# EAGLE design M_D_ext_power (EAGLE 9.6.2)
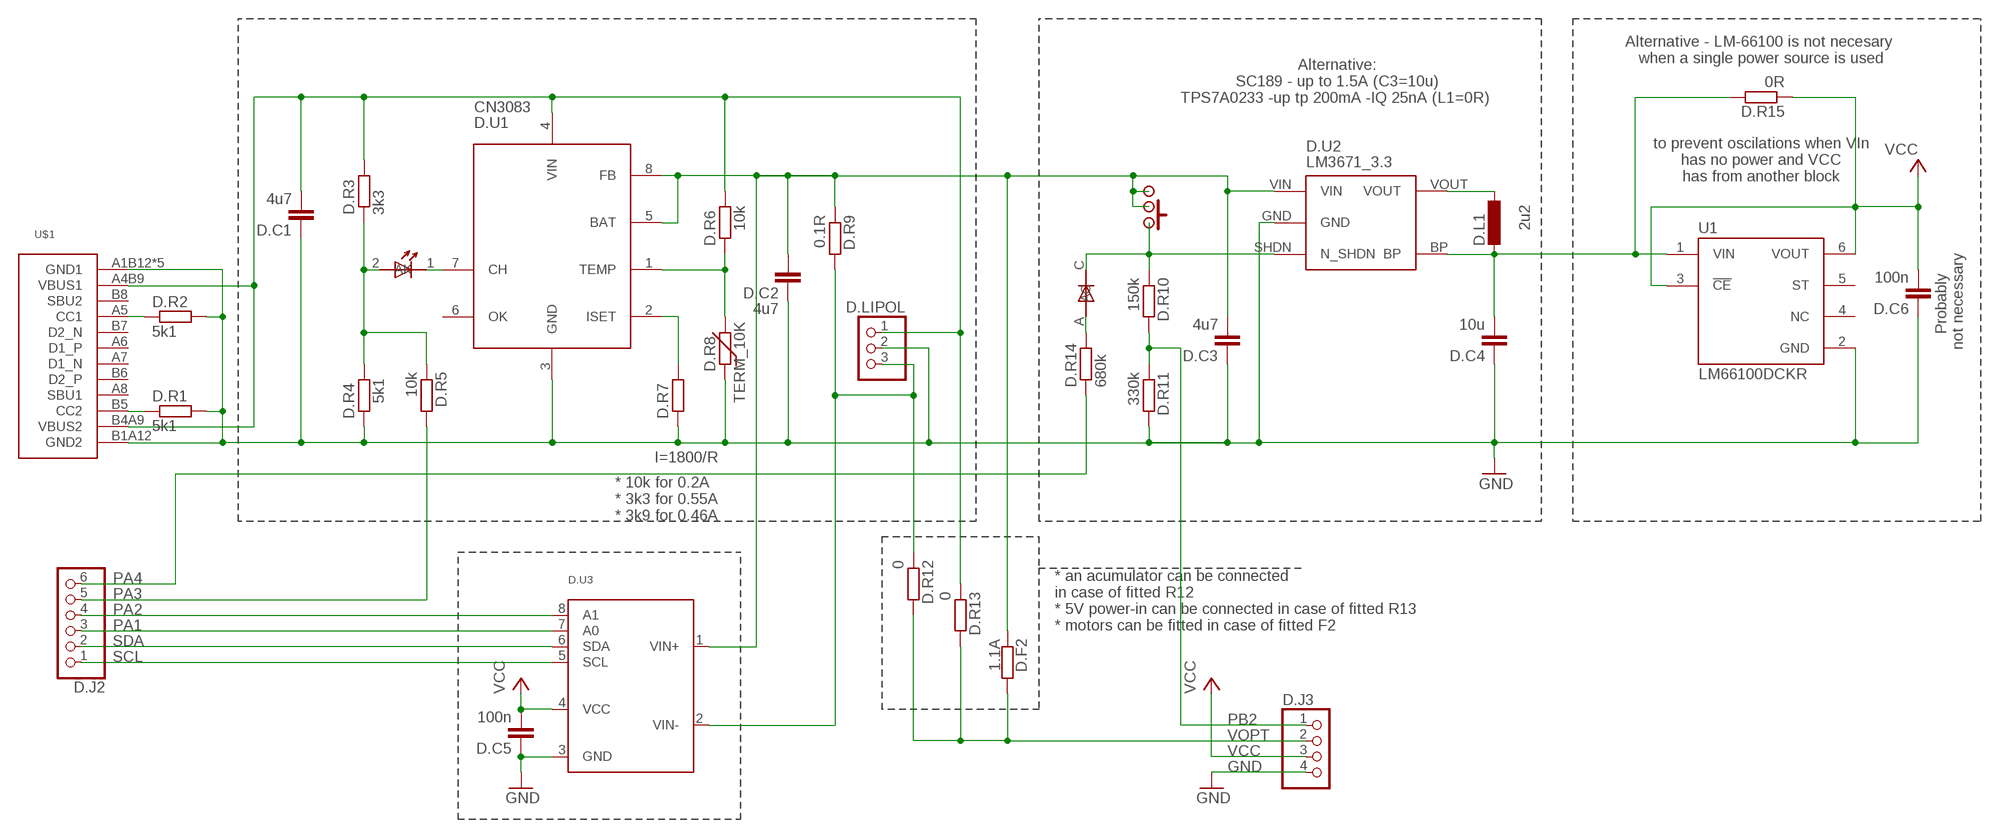
[diagram p0: schematic, sheet 1]

## Parts
D.C1  4u7  C-EUC0603  [C0603]
D.C2  4u7  C-EUC0603  [C0603]
D.C3  4u7  C-EUC0603  [C0603]
D.C4  10u  C-EUC0603  [C0603]
D.C5  100n  C-EUC0603  [C0603]
D.C6  100n  C-EUC0603  [C0603]
D.D1  LED_1.8  [LED_1.8]
D.D2  DIODE  [DIODE]
D.F2  1.1A  R-EU_R0805  [R0805]
D.J2  PINHD-1X6  [1X06]
D.J3  PINHD-1X4  [1X04]
D.L1  2u2  L-EUL3230M  [L3230M]
D.LIPOL  PINHEAD-1X3-2  [1X-03-2]
D.ON/OFF/RESET  SWITCH  [SWITCH]
D.R1  5k1  R-EU_R0603  [R0603]
D.R2  5k1  R-EU_R0603  [R0603]
D.R3  3k3  R-EU_R0603  [R0603]
D.R4  5k1  R-EU_R0603  [R0603]
D.R5  10k  R-EU_R0603  [R0603]
D.R6  10k  R-EU_R0603  [R0603]
D.R7  I=1800/R  R-EU_R0603  [R0603]
D.R8  TERM_10K  THERM  [THERM]
D.R9  0.1R  R-EU_R0805  [R0805]
D.R10  150k  R-EU_R0603  [R0603]
D.R11  330k  R-EU_R0603  [R0603]
D.R12  0  R-EU_R0603  [R0603]
D.R13  0  R-EU_R0603  [R0603]
D.R14  680k  R-EU_R0603  [R0603]
D.R15  0R  R-EU_R0603  [R0603]
D.U1  CN3083  [SOP8]
D.U2  LM3671_3.3  STABILISER_APE8865  [SOT32-5]
D.U3  INA219  [SOT23-8]
U1  LM66100DCKR  [SOT65P210X110-6N]
U$1  USB-C  [USB-C]

## Nets
5V: D.C1.2 D.LIPOL.1 D.R3.2 D.R6.2 D.R13.1 D.U1.4(VIN) U$1.A4B9(VBUS1) U$1.B4A9(VBUS2)
CHRG: D.D1.2(A) D.R3.1 D.R4.2 D.R5.1
GND: D.C1.1 D.C2.1 D.C3.1 D.C4.1 D.C5.1 D.C6.1 D.J3.4 D.LIPOL.2 D.R1.2 D.R2.2 D.R4.1 D.R7.1 D.R8.1 D.R11.2 D.U1.3(GND) D.U2.GND D.U3.3(GND) U1.2(GND) U$1.A1B12(GND1) U$1.B1A12(GND2) U$1.SH1(GND1) U$1.SH2(GND1) U$1.SH3(GND1) U$1.SH4(GND1)
IN+: D.C2.2 D.C3.2 D.F2.1 D.ON/OFF/RESET.P$2 D.ON/OFF/RESET.P$3 D.ON/OFF/RESET.P$4 D.ON/OFF/RESET.P$6 D.R9.1 D.U1.5(BAT) D.U1.8(FB) D.U2.VIN D.U3.1(VIN+)
IN-: D.LIPOL.3 D.R9.2 D.R12.1 D.U3.2(VIN-)
N$2: D.L1.1 D.U2.VOUT
N$3: D.D1.1(K) D.U1.7(CH)
N$4: D.R1.1 U$1.B5(CC2)
N$5: D.D2.A D.R14.2
N$6: D.R2.1 U$1.A5(CC1)
N$7: D.R7.2 D.U1.2(ISET)
N$8: D.R6.1 D.R8.2 D.U1.1(TEMP)
N$10: D.D2.C D.ON/OFF/RESET.P$1 D.ON/OFF/RESET.P$5 D.ON/OFF/RESET.P$7 D.R10.1 D.U2.SHDN(N_SHDN)
PA1: D.J2.3 D.U3.7(A0)
PA2: D.J2.4 D.U3.8(A1)
PA3: D.J2.5 D.R5.2
PA4: D.J2.6 D.R14.1
PB2: D.J3.1 D.R10.2 D.R11.1
SCL: D.J2.1 D.U3.5(SCL)
SDA: D.J2.2 D.U3.6(SDA)
VCC: D.C5.2 D.C6.2 D.J3.3 D.R15.1 D.U3.4(VCC) U1.3(!CE) U1.6(VOUT)
VCC1: D.C4.2 D.L1.2 D.R15.2 D.U2.BP U1.1(VIN)
VOPT: D.F2.2 D.J3.2 D.R12.2 D.R13.2
Unconnected: D.U1.6(OK) U1.4(NC) U1.5(ST) U$1.A6(D1_P) U$1.A7(D1_N) U$1.A8(SBU1) U$1.B6(D2_P) U$1.B7(D2_N) U$1.B8(SBU2)

## Notes on the sheet
- Alternative - LM-66100 is not necesary 
  when a single power source is used
- Alternative:
  SC189 - up to 1.5A (C3=10u)
  TPS7A0233 -up tp 200mA -IQ 25nA (L1=0R)
- to prevent oscilations when VIn
  has no power and VCC
  has from another block
- Probably 
  not necessary
- * 10k for 0.2A
  * 3k3 for 0.55A
  * 3k9 for 0.46A
- * an acumulator can be connected 
  in case of fitted R12  
  * 5V power-in can be connected in case of fitted R13 
  * motors can be fitted in case of fitted F2

## Library data of the parts
D.C1-D.C6 = rcl:C-EU: CAPACITOR, European symbol; SPICEPREFIX: C
D.D1 = hugo:LED_1.8
D.D2 = hugo:DIODE
D.F2 D.R1-D.R7 D.R9-D.R15 = rcl:R-EU_: RESISTOR, European symbol; SPICEPREFIX: R
D.J2 = pinhead2:PINHD-1X6: PIN HEADER
D.J3 = pinhead2:PINHD-1X4: PIN HEADER
D.L1 = rcl:L-EU: INDUCTOR, European symbol; SPICEPREFIX: L
D.LIPOL = pinhead2:PINHEAD-1X3-2
D.ON/OFF/RESET = hugo:SWITCH
D.R8 = hugo:THERM
D.U1 = hugo:CN3083
D.U2 = !stavebnice03:STABILISER_APE8865
D.U3 = hugo:INA219: INA219 - I2C Current/Power Monitor Voltage Range: 0-26V Accuracy: 0.5% Temperature: -40°C - 125°C
U1 = LM66100DCKR:LM66100DCKR: Check availability <https://pricing.snapeda.com/parts/LM66100DCKR/Texas%20Instruments/view-part?ref=eda>; AVAILABILITY: In Stock; CHECK_PRICES: https://www.snapeda.com/parts/LM66100DCKR/Texas+Instruments/view-part/?ref=eda; DESCRIPTION: 1.5-V to 5.5-V, 1.5-A, 0.5-µA IQ ideal diode with integrated FET; MF: Texas Instruments; MP: LM66100DCKR; PACKAGE: SOT-SC70-6 Texas Instruments; PRICE: None; SNAPEDA_LINK: https://www.snapeda.com/parts/LM66100DCKR/Texas+Instruments/view-part/?ref=snap
U$1 = hugo:USB-C

## Board
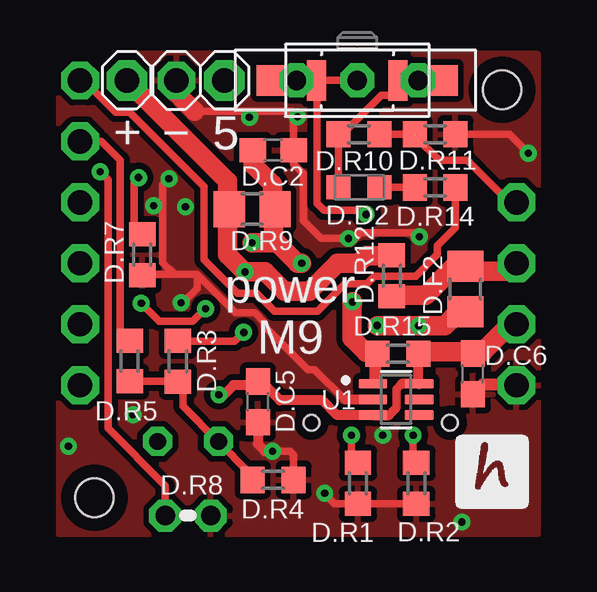
[diagram p1: board, top side]
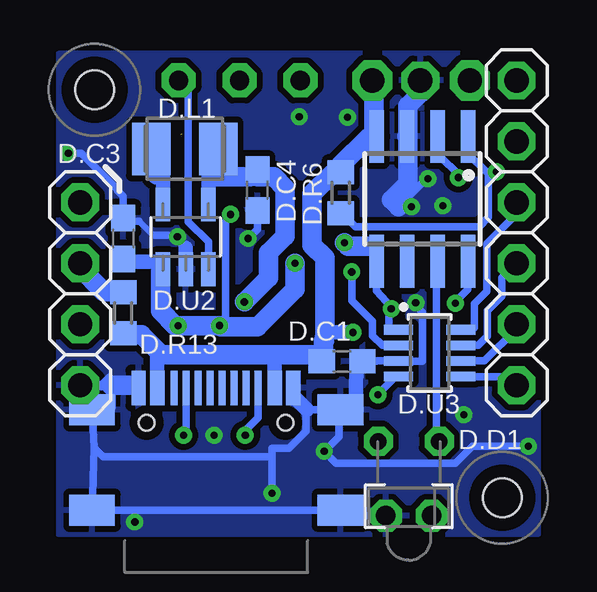
[diagram p2: board, bottom side, seen from below]

No outline drawn. Coordinates in mm, seen from the top.
Copper layers (1*16): Top 0.035mm / dielectric 1.5mm / Bottom 0.035mm
Design rules "default *": minimum track width 10mil, minimum drill 0.3mm, track to track 6mil, track to pad 6mil, pad to pad 6mil, via to via 10mil, smd to smd 10mil, copper to edge 15mil, drill to drill 15mil, minimum pad ring 10mil, minimum via ring 8mil, stop-mask expansion 4mil, vias tented up to drill 14mil, thermal gap 10mil
Holes 1.6 mm at 2,2 19,19
tRestrict: area 18,18 to 20,20; area 1,1 to 3,3
bRestrict: area 1,1 to 3,3; area 18,18 to 20,20

### Footprints (pad centres in the part's own frame; a part is rotated, then mirrored left to right if it is on the bottom)
C0603 = smd 1.1 x 1: 1 -0.85,0; 2 0.85,0
LED_1.8 = drill 0.7 octagon: 1 -1.27,-0.4; 2 1.27,-0.4
DIODE = smd 1 x 1: A 0.85,0; C -0.85,0
R0805 = smd 1.3 x 1.5: 1 -0.95,0; 2 0.95,0
1X06 = drill 1.016 pad 1.575 octagon: 1 -6.35,0; 2 -3.81,0; 3 -1.27,0; 4 1.27,0; 5 3.81,0; 6 6.35,0
1X04 = drill 1.016 pad 1.575 octagon: 1 -3.81,0; 2 -1.27,0; 3 1.27,0; 4 3.81,0
L3230M = smd 1.6 x 2.2: 1 -1.4,0; 2 1.4,0
1X-03-2 = drill 1.016 pad 1.676 octagon: 1 -2.016,0; 3 2.048,0 | drill 1.016 pad 1.575 octagon: 2 -0.016,0
SWITCH = drill 0.8 pad 1.422 octagon: P$1 2.54,0; P$2 0,0; P$3 -2.54,0 | smd 0.8 x 1.7: P$4 -1.7,0; P$5 1.7,0 | smd 1.27 x 1.27: P$6 -3.556,0; P$7 3.556,0
R0603 = smd 1 x 1.1: 1 -0.85,0; 2 0.85,0
THERM = drill 0.813 octagon: 1 -0.953,0; 2 0.953,0
SOP8 = smd 0.6 x 2.2: 1 -1.905,-2.6; 2 -0.635,-2.6; 3 0.635,-2.6; 4 1.905,-2.6; 5 1.905,2.6; 6 0.635,2.6; 7 -0.635,2.6; 8 -1.905,2.6
SOT32-5 = smd 0.6 x 1.4: BP 0.95,1.35; GND 0,-1.35; SHDN 0.95,-1.35; VIN -0.95,-1.35; VOUT -0.95,1.35
SOT23-8 = smd 0.4 x 1.2: 1 -0.975,-1.3; 2 -0.325,-1.3; 3 0.325,-1.3; 4 0.975,-1.3; 5 0.975,1.3; 6 0.325,1.3; 7 -0.325,1.3; 8 -0.975,1.3
SOT65P210X110-6N = smd 1.19 x 0.4: 1 -0.96,0.65; 2 -0.96,0; 3 -0.96,-0.65; 4 0.96,-0.65; 5 0.96,0; 6 0.96,0.65
USB-C = smd 0.6 x 1.45: A1B12 -3.235,3.825; A4B9 -2.46,3.825; B1A12 3.215,3.825; B4A9 2.44,3.825 | smd 0.3 x 1.45: A5 -1.26,3.825; A6 -0.26,3.825; A7 0.24,3.825; A8 1.24,3.825; B5 1.74,3.825; B6 0.74,3.825; B7 -0.76,3.825; B8 -1.76,3.825 | smd 1.9 x 1.3: SH1 -5.18,2.91; SH2 -5.18,-1.27; SH3 5.18,-1.27; SH4 5.18,2.91 | hole 0.65: 2.88,2.38; -2.9,2.38

### Placement (x,y rotation side)
D.C1  8.68,7.68 180 bottom
D.C2  9.45,16.49 180 top
D.C3  17.81,12.8 270 bottom
D.C4  12.21,14.82 90 bottom
D.C5  8.81,5.99 90 top
D.C6  17.78,7.16 90 top
D.D1  5.9,3.95 180 bottom
D.D2  13.03,14.94 0 top
D.F2  17.47,10.7 90 top
D.J2  1.4,13.04 90 bottom
D.J3  19.6,10.5 270 bottom
D.L1  15.24,16.54 0 bottom
D.LIPOL  5.4,19.39 180 top
D.ON/OFF/RESET  12.96,19.39 0 top
D.R1  12.99,2.6 270 top
D.R2  15.42,2.6 270 top
D.R3  5.48,7.69 90 top
D.R4  9.45,2.74 180 top
D.R5  3.47,7.7 90 top
D.R6  8.74,14.71 90 bottom
D.R7  4,12.12 90 top
D.R8  5.9,1.25 180 top
D.R9  8.58,14.03 180 top
D.R10  13.03,17.14 0 top
D.R11  16.21,17.14 0 top
D.R12  14.4,11.25 270 top
D.R13  17.81,9.7 90 bottom
D.R14  16.21,14.94 180 top
D.R15  14.66,8 180 top
D.U1  5.33,14.45 180 bottom
D.U2  15.2,12.87 0 bottom
D.U3  5.03,8.03 270 bottom
U1  14.58,6.1 0 top
U$1  13.93,2.75 0 bottom

### Tracks (layer width: path | path; a pad name or v marks a point on that pad's centre or on a via)
5V  (via drill 0.3)
  Top 0.305: D.R3.2 5.5,8.51 7.85,8.51 v8.22,8.89
  Bottom 0.254: 16.28,7.96 16.2,7.96
  Bottom 0.61: 11.49,7.02 U$1.B4A9 11.49,7.87 11.4,7.96 | D.R6.2 8.79,15.51 9.08,15.51 | U$1.A4B9 16.39,7.84 16.28,7.96 | 7.34,17.15 D.U1.4 7.26,17.03 7.57,17.03 | v8.22,8.89 9.4,8.89 | 9.4,8.69 9.42,8.69 | 9.42,8.53 9.45,8.53
  Bottom 0.813: D.R6.2 8.74,15.86 7.57,17.03 | 9.08,15.51 9.93,14.66 9.93,12.53 9.4,12 9.4,8.89 9.4,8.69 | D.C1.2 9.65,7.8 9.65,7.96 | 9.65,7.96 9.46,7.96 9.45,7.97 9.45,8.53 | 9.65,7.96 11.4,7.96 16.2,7.96 17.04,8.8 17.75,8.8 D.R13.1 | 7.34,17.15 7.34,18.88 7.67,19.21 D.LIPOL.1 | 9.42,8.69 9.42,8.53
CHRG
  Top 0.305: D.R4.2 8.6,2.9 7.05,4.45 7.05,4.35 D.D1.2 5.69,5.81 5.69,6.63 D.R3.1 D.R5.1
  Bottom 0.305: D.D1.2
GND  (via drill 0.3)
  Top 0.305: v11.6,2.18 11.6,2.16 12.01,1.75 12.9,1.75 12.88,1.77 D.R1.2 | 20.04,16.41 v20.09,16.36 19.3,17.14 D.R11.2 | D.R1.2 12.98,1.75 | D.R2.2 D.R1.2 | 8.59,18.11 10.26,18.11 10.3,18.07 D.C2.1 10.3,15.91 10.72,15.5 10.72,13.54 11.44,12.82 12.58,12.82 v12.6,12.8 12.46,12.66 12.73,12.66 13.11,13.04 15.38,13.04 v15.54,12.88 | 8.59,18.11 6.17,18.11 | v9.42,3.94 10.15,3.94 10.3,3.79 D.R4.1 | v5.61,10.12 5.7,10.12 6.29,10.71 6.29,11.3 6.28,11.3 | D.R7.1 4.03,11.3 5.33,11.3 | 6.28,11.3 5.33,11.3 | 6.28,11.3 7.88,9.7 8.69,9.7 9.07,9.32 9.07,9.17 10.9,7.34 11.18,7.34 12.42,6.1 12.45,6.1 | D.C6.1 18.18,6.71 | 5.33,11.3 4.85,11.79 4.85,15.04 v5.11,15.29 | v8.46,17.86 8.59,17.98 8.59,18.11
  Top 0.406: D.C5.1 8.81,4.23 9.11,3.94 v9.42,3.94 | 12.45,6.1 U1.2 | 19.57,6.71 D.J3.4
  Top 0.508: 19.57,6.71 18.18,6.71
  Top 0.61: 5.44,18.84 5.42,18.89 D.LIPOL.2
  Top 0.813: 6.17,18.11 5.44,18.84
  Bottom 0.254: 17.14,13.53 16.55,12.93
  Bottom 0.305: 11.6,3.72 18.64,3.72 19.01,4.09 | U$1.SH4 8.92,5.71 9.45,5.71 9.33,5.59 8.81,5.59 | U$1.SH1 19.01,4.09 | 19.01,4.09 U$1.SH2 U$1.SH3 8.64,1.25 D.R8.1 | 11.6,2.32 v11.6,2.18 | v11.6,2.18 11.58,2.16 | v11.6,2.18 11.6,3.72 | 11.6,3.72 11.6,4.07 10.89,4.07 10.19,4.78 10.19,5.49 10.02,5.66 U$1.SH4 | 8.11,5.6 8.13,5.59 8.81,5.59 | 8.08,7.43 D.C1.1 7.24,7.68 7.23,7.7 D.U3.3 5.32,7.69 5.32,7.7 5.32,9.73 5.65,10.06 v5.62,10.12 v5.61,10.12 | 10.71,6.24 U$1.B1A12 | U$1.SH4 10.14,5.66 | v20.09,16.36 19.56,16.36 18.06,14.86 18.06,14.82 17.8,14.57 D.C3.1 17.68,13.53 17.14,13.53 | v0.91,4.14 3.24,4.14 3.95,3.44 8.93,3.44 v9.42,3.94 8.81,4.55 8.81,5.59 | 6.33,14.12 5.16,15.29 v5.11,15.29 | 15.2,12.41 15.6,12.8 15.6,12.93 | 16.55,12.93 15.54,12.93 v15.54,12.88 | v12.6,12.8 12.21,13.19 D.C4.1
  Bottom 0.406: 18.37,6.98 18.5,6.85 | 18.5,6.85 18.66,6.69 | U$1.A1B12 17.16,6.6 17.33,6.77 17.41,6.69 | 18.66,6.69 D.J3.4 19.6,6.25 | 18.66,6.69 18.31,6.69 | 18.5,6.85 18.34,6.68 18.34,5.71
  Bottom 0.61: 8.81,5.84 8.87,5.79 U$1.SH4 8.74,5.79 | 19.6,6.25 U$1.SH1 | U$1.B1A12 10.71,6.65 | D.U1.3 5.97,18.23 | 8.11,5.6 8.08,7.43 | 10.14,5.66 10.71,6.24 | 15.2,12.41 D.U2.GND | D.LIPOL.2 5.42,18.86
  Bottom 0.813: 18.31,6.69 17.41,6.69 | 6.33,14.12 6.63,14.43 5.94,15.11 5.94,17.03 | D.U1.3 5.94,17.05 5.94,18.33 5.42,18.86
  other vias: 5.79,14.12 17.32,0.99 10.46,17.88 4.47,14.17 14.02,4.6 3.61,5.46
  pour Top (isolate 0.254): 0.5,20.5 0.5,0.5 20.5,0.5 20.5,20.5
  pour Bottom (isolate 0.254, rank 3): 0.5,20.5 20.5,20.5 20.5,0.5 0.5,0.5
IN+  (via drill 0.3)
  Top 0.305: D.ON/OFF/RESET.P$6 D.ON/OFF/RESET.P$3 D.ON/OFF/RESET.P$4 | 12.94,19.39 D.ON/OFF/RESET.P$2 D.ON/OFF/RESET.P$4 | v13.33,13.8 13.15,13.98 11.58,13.98 11.29,14.28 11.29,19.36 D.ON/OFF/RESET.P$4 | v3.96,10.1 4.69,9.36 6.1,9.36 v6.63,9.87
  Top 0.813: D.R9.1 9.42,14.13 9.42,15.06 8.6,15.88 D.C2.2 | D.R9.1 9.61,14.03 | D.R9.1 9.47,13.97 9.47,12.62 v8.58,12.62 9.61,12.62 10.46,11.77 v10.64,11.77 | 17.35,9.6 17.35,9.63 D.F2.1 17.19,9.75 16.61,9.18 v15.53,9.18 v15.52,9.17 v15.51,9.18 v13.79,9.18 15.31,9.18
  Bottom 0.305: D.U2.VIN 16.15,11.82 | D.C3.2 17.59,11.74 17.6,11.82 | v13.33,13.8 13.33,13.7 13.54,13.5 13.54,9.43 v13.79,9.18 | D.U3.1 6.63,9 6.74,9.1 6.74,9.77 v6.63,9.87 6.63,9.93 7.24,10.63 D.U1.5 | v3.96,10.1 3.96,10.16 3.43,10.68 D.U1.8
  Bottom 0.508: 7.37,12.47 7.24,12.6 | 7.24,12.42 7.19,12.47
  Bottom 0.61: 7.24,12.45 D.U1.5 7.24,12.42 7.24,12.6 | 17.6,11.82 16.15,11.82 | D.U2.VIN 16.25,11.42
  Bottom 0.813: v8.58,12.62 8.43,12.47 7.37,12.47 | 16.25,11.42 16.25,9.79 15.64,9.18 v13.79,9.18 13.74,9.12 12.21,9.12 10.64,10.69 v10.64,11.77
IN-  (via drill 0.3)
  Top 0.813: D.LIPOL.3 7.55,15.19 7.55,14.33 7.62,14.25 D.R9.2 7.62,13.57 7.54,13.49 7.54,12.13 8.26,11.41 v8.28,11.41 9.12,11.41 9.92,10.61 10.97,10.61 12.13,11.76 13.02,11.76 13.33,12.08 14.38,12.08 D.R12.1
  Bottom 0.305: D.U3.2 7,8.34 7.41,8.75 7.41,9.35 8.28,10.22 v8.28,11.41
N$2
  Bottom 0.61: D.U2.VOUT 16.15,15.34 16.36,15.54 | D.L1.1 16.36,16.54
  Bottom 1.016: 16.36,16.54 16.36,15.54
N$3
  Bottom 0.305: D.U1.7 4.75,11.8 4.75,4.47 D.D1.1
N$4  (via drill 0.3)
  Top 0.305: D.R1.1 12.72,3.81 v12.72,4.6
  Bottom 0.305: U$1.B5 12.19,5.33 12.72,4.8 v12.72,4.6
N$5
  Top 0.305: D.R14.2 D.D2.A
N$6  (via drill 0.3)
  Top 0.305: D.R2.1 15.29,3.67 v15.29,4.6
  Bottom 0.305: U$1.A5 15.19,4.72 v15.29,4.6
N$7  (via drill 0.3)
  Top 0.305: v3.83,15.34 3.66,15.16 3.66,13.31 D.R7.2
  Bottom 0.305: D.U1.2 4.57,16.93 4.57,16.21 3.83,15.48 v3.83,15.34
N$8  (via drill 0.3)
  Top 0.305: D.R8.2 4.95,2.51 2.56,4.89 2.56,15.26 v2.24,15.59
  Bottom 0.305: 8.66,13.86 D.R6.1 8.69,13.86 8.13,13.3 2.95,13.3 2.57,13.68 2.57,15.43 2.42,15.59 v2.24,15.59 2.67,15.59 3.4,16.32 3.4,17.03 D.U1.1
N$10
  Top 0.305: D.ON/OFF/RESET.P$1 D.ON/OFF/RESET.P$5 14.66,19.32 | D.ON/OFF/RESET.P$1 15.36,19.35 | D.ON/OFF/RESET.P$1 D.ON/OFF/RESET.P$7 | D.ON/OFF/RESET.P$1 14.94,19.39 14.33,18.78 13.97,18.78 12.33,17.14 D.R10.1 D.D2.C
  Bottom 0.305: D.U2.SHDN 14.25,12.66 15.1,13.51 15.1,18.99 D.ON/OFF/RESET.P$1
PA1
  Bottom 0.305: D.U3.7 3,8.34 2.62,8.73 2.62,9.78 2.01,10.39 2.01,11.16 D.J2.3
PA2
  Bottom 0.305: D.J2.4 1.4,13.83 2.65,12.58 2.65,10.6 3.17,10.08 3.17,9.08 3.25,9 D.U3.8
PA3
  Top 0.305: D.R5.2 3.07,8.95 3.07,16.07 2.29,16.85 D.J2.5
PA4
  Top 0.305: D.R14.1 17.05,13.26 16.3,12.5 16.3,12.14 15.4,11.24 13.67,11.24 13.36,10.93 12.45,10.93 11.3,9.78 9.5,9.78 8.76,10.52 7.97,10.52 6.58,11.91 6.58,14.96 3.47,18.07 2.88,18.07 1.56,19.39 D.J2.6 1.58,19.39
PB2  (1 unrouted)
  Top 0.305: D.R11.1 D.R10.2 | 15.41,17.12 15.43,17.1 15.43,17 16.38,16.05 17.55,16.05 19.3,14.31 D.J3.1
SCL
  Bottom 0.305: D.U3.5 1.76,7.05 D.J2.1
SDA
  Bottom 0.305: D.J2.2 1.4,9.04 2.74,7.7 D.U3.6
VCC  (via drill 0.3)
  Top 0.305: 8.94,6.84 D.C5.2 | D.C6.2 19,9.23 D.J3.3
  Top 0.356: 14.81,6.75 14.59,6.53 14.59,5.75 14.28,5.45
  Top 0.406: 9.02,6.64 D.C5.2 8.66,6.69 7.8,6.69 7.4,6.29 v7.19,6.29 | 14.81,6.75 U1.6 15.51,6.78 D.R15.1 | 14.28,5.45 U1.3 12.12,5.45 11.51,6.06 9.73,6.06 8.94,6.84
  Top 0.61: 19.37,9.23 D.J3.3
  Top 0.813: 19.37,9.23 18.21,8.07 15.58,8.07 D.R15.1
  Bottom 0.305: 7.19,6.32 6.46,7.05 D.U3.4
  Bottom 0.406: v7.19,6.29 7.19,6.32
VCC1  (via drill 0.3)
  Top 0.305: 13.37,8.07 13.62,7.81 U1.1 13.81,6.93 D.R15.2
  Top 0.61: v12.75,10.16
  Top 0.813: v12.75,10.16 12.75,10.06 12.73,10.03 12.73,8.65 13.31,8.07 13.37,8.07
  Bottom 0.305: D.C4.2 12.21,15.37
  Bottom 0.406: D.U2.BP 14.25,14.45
  Bottom 0.508: 14.25,16.12 D.L1.2
  Bottom 0.61: D.U2.BP 14.25,16.12
  Bottom 0.813: v12.75,10.16 11.74,11.18 11.74,12.22 11.05,12.91 11.05,14.89 11.53,15.37 12.21,15.37 | 14,16.38 D.L1.2 13.89,16.48 13.89,15.88 13.92,15.9 13.92,15.37 12.51,15.37 D.C4.2
VOPT
  Top 0.813: D.J3.2 19.27,11.44 17.67,11.44 D.F2.2 17.43,11.68 17.06,11.68 15.81,10.44 14.44,10.44 D.R12.2
  Bottom 0.813: D.R13.2 17.84,10.59 18.61,10.59 19.6,11.58 D.J3.2

### Text on the board
tPlace: + | − | 5 | power / M9